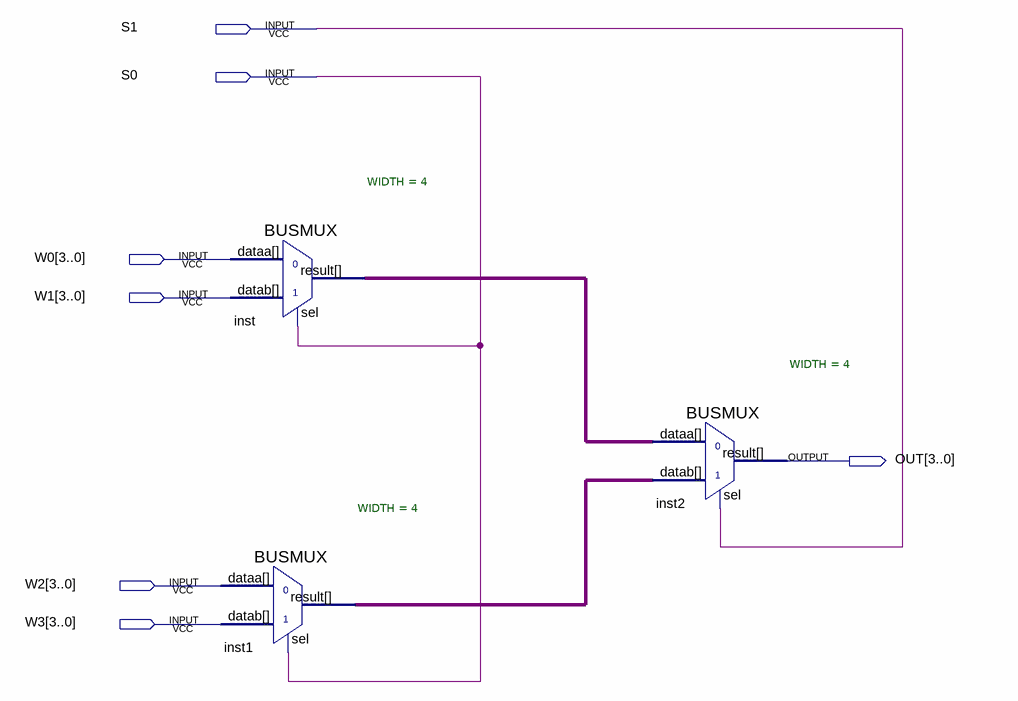
[diagram p0: schematic sheet]
// Quartus schematic Mux4_4b.bdf as structural Verilog: 3 symbols, 7 pins
module Mux4_4b (
  input  S1,
  input  S0,
  input  [3:0] W0,
  input  [3:0] W1,
  input  [3:0] W2,
  input  [3:0] W3,
  output [3:0] OUT
);

  wire [3:0] inst1_result, inst_result;

  BUSMUX #(.WIDTH(4)) inst (.datab(W1), .sel(S0), .dataa(W0), .result(inst_result));
  BUSMUX #(.WIDTH(4)) inst1 (.datab(W3), .sel(S0), .dataa(W2), .result(inst1_result));
  BUSMUX #(.WIDTH(4)) inst2 (.datab(inst1_result), .sel(S1), .dataa(inst_result), .result(OUT));
endmodule
